# EAGLE design og-hello (EAGLE 7.7.0)
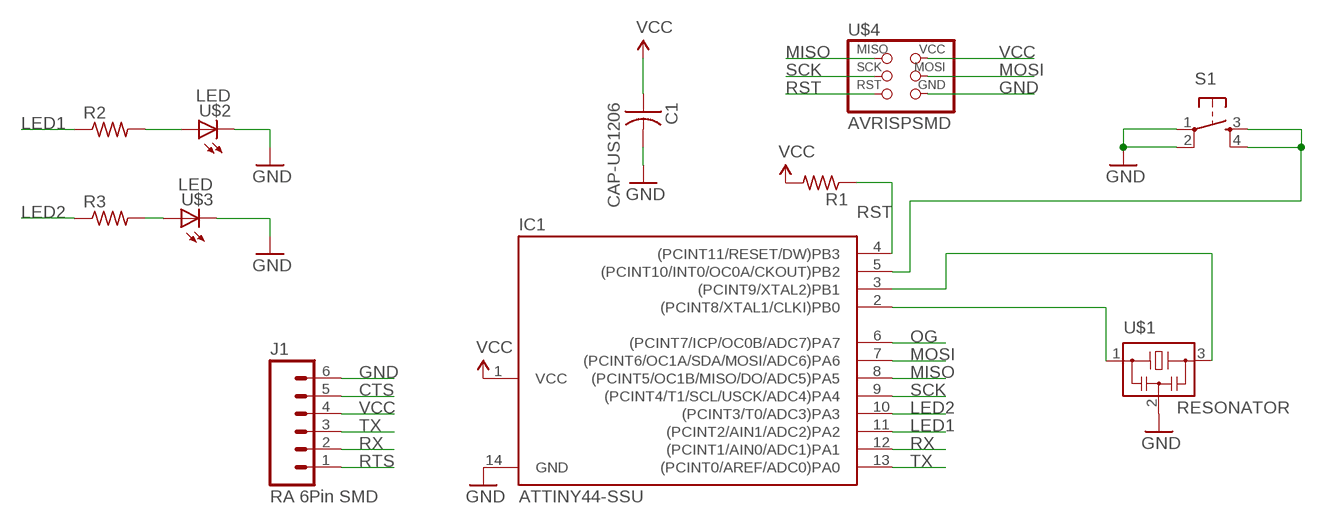
[diagram p0: schematic, sheet 1]

## Parts
C1  CAP-US1206  [C1206]
IC1  ATTINY44-SSU  [SOIC14]
J1  RA 6Pin SMD  M06SMD  [1X06-SMD]
R1  RES-US1206  [R1206]
R2  RES-US1206  [R1206]
R3  RES-US1206  [R1206]
S1  6MM_SWITCH6MM_SWITCH  [6MM_SWITCH]
U$1  RESONATOR  [EFOBM]
U$2  LED  [LED1206]
U$3  LED  [LED1206]
U$4  AVRISPSMD  [2X03SMD]

## Nets
CTS: J1.5
GND: C1.2 IC1.14(GND) J1.6 S1.1(P) S1.2(P1) U$1.2 U$2.2(C) U$3.2(C) U$4.6(GND)
LED1: IC1.11((PCINT2/AIN1/ADC2)PA2) R2.1
LED2: IC1.10((PCINT3/T0/ADC3)PA3) R3.1
MISO: IC1.8((PCINT5/OC1B/MISO/DO/ADC5)PA5) U$4.1(MISO)
MOSI: IC1.7((PCINT6/OC1A/SDA/MOSI/ADC6)PA6) U$4.4(MOSI)
N$1: IC1.3((PCINT9/XTAL2)PB1) U$1.3
N$2: IC1.5((PCINT10/INT0/OC0A/CKOUT)PB2) S1.3(S) S1.4(S1)
N$3: R3.2 U$3.1(A)
N$5: R2.2 U$2.1(A)
N$14: IC1.2((PCINT8/XTAL1/CLKI)PB0) U$1.1
OG: IC1.6((PCINT7/ICP/OC0B/ADC7)PA7)
RST: IC1.4((PCINT11/RESET/DW)PB3) R1.1 U$4.5(RST)
RTS: J1.1
RX: IC1.12((PCINT1/AIN0/ADC1)PA1) J1.2
SCK: IC1.9((PCINT4/T1/SCL/USCK/ADC4)PA4) U$4.3(SCK)
TX: IC1.13((PCINT0/AREF/ADC0)PA0) J1.3
VCC: C1.1 IC1.1(VCC) J1.4 R1.2 U$4.2(VCC)

## Library data of the parts
C1 = fab-library:CAP-US
IC1 = fab-library:ATTINY44
J1 = SparkFun-Connectors:M06: Header 6 Standard 6-pin 0.1" header. Use with straight break away headers (SKU : PRT-00116), right angle break away headers (PRT-00553), swiss pins (PRT-00743), machine pins (PRT-00117), and female headers (PRT-00115). Molex polarized connector foot print use with SKU : PRT-08094 with associated crimp pins and housings. NOTES ON THE VARIANTS LOCK and LOCK_LONGPADS... This footprint was designed to help hold the alignment of a through-hole component (i.e. 6-pin header) while soldering it into place. You may notice that each hole has been shifted either up or down by 0.005 of an inch from it's more standard position (which is a perfectly straight line). This slight alteration caused the pins (the squares in the middle) to touch the edges of the holes. Because they are alternating, it causes a "brace" to hold the component in place. 0.005 has proven to be the perfect amount of "off-center" position when using our standard breakaway headers. Although looks a little odd when you look at the bare footprint, once you have a header in there, the alteration is very hard to notice. Also,if you push a header all the way into place, it is covered up entirely on the bottom side. This idea of altering the position of holes to aid alignment will be further integrated into the Sparkfun Library for other footprints. It can help hold any component with 3 or more connection pins.; PROD_ID: CONN-08971
R1-R3 = fab-library:RES-US: Resistor (US Symbol) Variants with postfix FAB are widened to allow the routing of internal traces
S1 = fab-library:6MM_SWITCH: OMRON SWITCH
U$1 = fab-library:RESONATOR
U$2 U$3 = fab-library:LED: LED
U$4 = fab-library:AVRISP

## Board
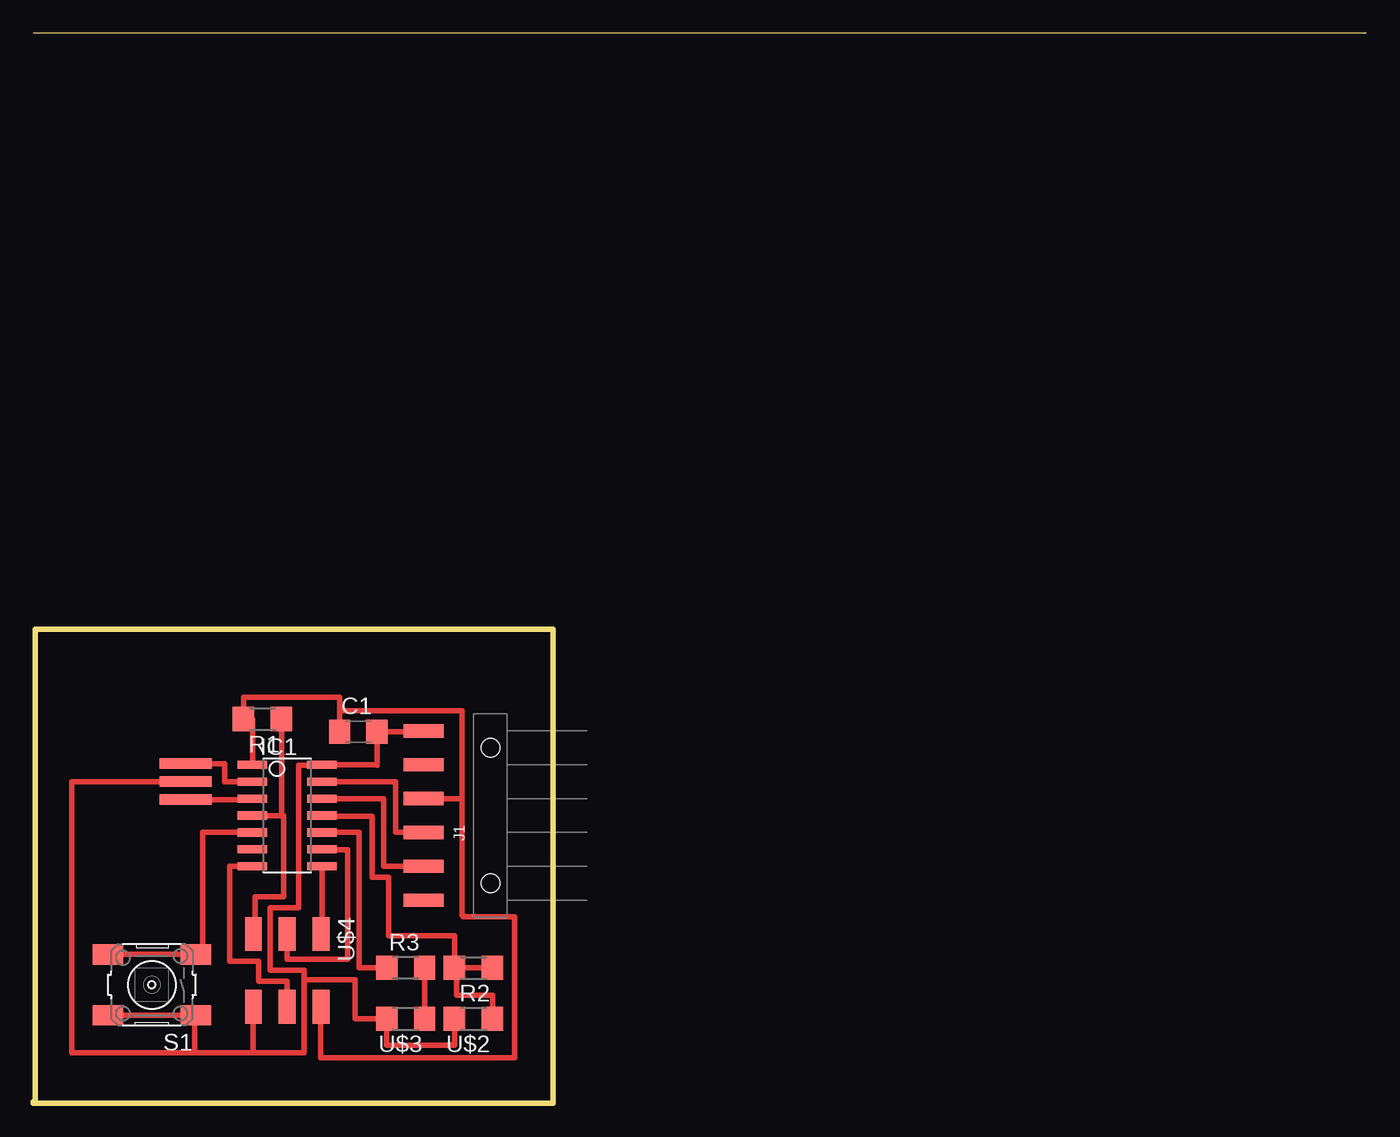
[diagram p1: board, top side]

Size 100 x 80.25 mm. Coordinates in mm from the lower left corner, seen from the top.
Outline: 100,80.25 0,80.25
Outline: 0.13,0.13 0.13,35.56
Outline: 0.25,35.56 38.99,35.56 38.99,0 0,0 0,0.13
Copper layers (1*16): Top 0.035mm / dielectric 1.5mm / Bottom 0.035mm
Design rules "default *": minimum track width 10mil, minimum drill 24mil, track to track 16mil, track to pad 16mil, pad to pad 16mil, via to via 16mil, smd to smd 8mil, copper to edge 40mil, drill to drill 8mil, minimum pad ring 10mil, minimum via ring 8mil, stop-mask expansion 4mil, vias tented up to drill 0mil, thermal gap 10mil

### Footprints (pad centres in the part's own frame; a part is rotated, then mirrored left to right if it is on the bottom)
C1206 = smd 1.6 x 1.8: 1 -1.4,0; 2 1.4,0
SOIC14 = smd 0.61 x 2.21: 1 -3.81,-2.603; 2 -2.54,-2.603; 3 -1.27,-2.603; 4 0,-2.603; 5 1.27,-2.603; 6 2.54,-2.603; 7 3.81,-2.603; 8 3.81,2.603; 9 2.54,2.603; 10 1.27,2.603; 11 0,2.603; 12 -1.27,2.603; 13 -2.54,2.603; 14 -3.81,2.603
1X06-SMD = smd 1 x 3: 1 -6.35,5; 2 -3.81,5; 3 -1.27,5; 4 1.27,5; 5 3.81,5; 6 6.35,5 | hole 1.4: -5.08,0; 5.08,0
R1206 = smd 1.6 x 1.803: 1 -1.422,0; 2 1.422,0
6MM_SWITCH = smd 2.286 x 1.524: 1 -3.302,2.286; 2 3.302,2.286; 3 -3.302,-2.286; 4 3.302,-2.286
EFOBM = smd 0.8 x 3.9: 1 -1.35,0; 2 0,0; 3 1.35,0
LED1206 = smd 1.6 x 1.803: 1 -1.422,0; 2 1.422,0
2X03SMD = smd 2.54 x 1.27: 1 -2.54,2.54; 2 2.92,2.54; 3 -2.54,0; 4 2.92,0; 5 -2.54,-2.54; 6 2.92,-2.54

### Placement (x,y rotation side)
C1  24.38,27.89 0 top
IC1  19.05,21.59 270 top
J1  34.29,21.59 90 top
R1  17.2,28.83 180 top
R2  33.02,10.16 180 top
R3  27.94,10.16 0 top
S1  8.89,8.89 180 top
U$1  11.43,24.13 270 top
U$2  33.02,6.35 180 top
U$3  27.94,6.35 180 top
U$4  19.05,10.16 270 top

### Tracks (layer width: path | path; a pad name or v marks a point on that pad's centre or on a via)
GND
  Top 0.406: 16.51,3.81 U$4.6 16.48,7.24 16.48,3.81 | 16.51,3.81 16.48,3.81 | 16.48,3.81 12.09,3.81 | 12.09,3.81 2.9,3.81 2.9,24.13 U$1.2 | 16.51,3.81 20.32,3.81 20.32,9.27 | J1.6 29.29,27.89 C1.2 25.78,25.38 25.81,25.38 25.81,25.4 IC1.14 21.65,25.38 19.89,25.38 19.89,14.66 17.78,14.66 17.78,9.98 20.32,9.98 20.32,9.27 | 12.09,3.81 12.09,6.6 S1.1 S1.2 | U$2.2 | U$2.2 31.6,4.34 26.52,4.34 U$3.2 24.13,6.35 24.13,9.27 20.32,9.27
LED1
  Top 0.406: R2.1 31.62,10.16 31.62,12.57 26.67,12.57 26.67,16.94 25.4,16.94 25.4,21.54 21.65,21.54 IC1.11 21.65,21.57
LED2
  Top 0.406: R3.1 24.43,10.16 24.43,20.32 IC1.10 21.59,20.32
MISO
  Top 0.406: U$4.1 21.65,12.7 IC1.8
MOSI
  Top 0.406: U$4.4 19.05,7.37 18.92,7.37 18.92,8.13 | U$4.4 18.92,7.24 18.92,6.86 19.43,6.86 19.43,7.24 U$4.4 | U$4.4 19.05,9.14 16.89,9.14 16.89,10.67 14.73,10.67 14.73,17.78 IC1.7
N$1
  Top 0.406: U$1.3 16.45,22.78 IC1.3
N$2
  Top 0.406: S1.4 S1.3 12.7,11.18 12.7,20.32 IC1.5 | 16.45,20.3 IC1.5 | 17.02,20.32 IC1.5
N$3
  Top 0.406: U$3.1 R3.2
N$5
  Top 0.406: R2.2 31.75,10.16 31.75,8.13 34.44,8.13 U$2.1
N$14
  Top 0.406: 17.02,24.13 IC1.2 14.35,24.13 14.35,25.48 U$1.1
RST
  Top 0.406: U$4.5 16.64,12.7 16.64,15.49 18.8,15.49 18.8,21.59 18.62,21.59 | 16.45,21.57 IC1.4 18.62,21.59 | 19.15,28.14 19.02,28.14 19.02,28.27 18.62,28.27 | 18.62,28.27 R1.1 | 18.62,21.59 18.62,28.27
RX
  Top 0.406: IC1.12 21.65,22.84 26.29,22.84 26.29,17.78 J1.2 30.23,17.78
SCK
  Top 0.406: U$4.3 19.05,10.79 23.6,10.79 23.6,19.03 21.65,19.03 IC1.9
TX
  Top 0.406: 29.82,20.32 29.82,20.3 29.29,20.3 | 28.78,20.3 29.29,20.3 | 29.29,20.3 J1.3 30.3,20.32 30.3,20.35 29.82,20.35 29.82,20.32 | IC1.13 27.18,24.13 27.18,20.32 29.82,20.32
VCC
  Top 0.406: IC1.1 16.45,28.83 R1.2 15.77,29.46 15.77,30.46 22.99,30.46 C1.1 22.98,29.44 32.18,29.44 32.18,22.86 | J1.4 32.18,22.86 | U$4.2 21.57,7.24 21.57,3.43 36.09,3.43 36.09,13.99 32.23,13.99 32.23,14.12 32.18,14.12 32.18,22.86